# Altium schematic sheet rtc.SchDoc
size A4; Engineer: Amir Hossein Jobeiri; Organization: Simaran; SheetNumber: 15; SheetTotal: 24
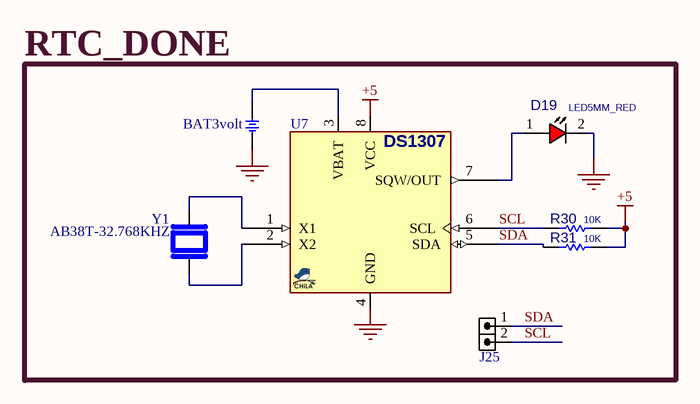
[diagram p0: rtc.SchDoc]

## Parts
BT1  BAT3volt  [BTH2032]
D19  LED5MM_RED  [LED5MM_RED]
J25  HDRM2  [HDR_M_1X2]  (value not drawn)
R30  10K  [R025W_AX04]
R31  10K  [R025W_AX04]
U7  DS1307  [DIP_8]  (value not drawn)
Y1  AB38T-32.768KHZ  [XTAL_AB38T-32.768KHZ]

## Blocks framed on the sheet
RTC_DONE: BT1 D19 J25 R30 R31 U7 Y1

## Nets
+5: R30.1 R31.1 U7.8(VCC)
GND: BT1.2 D19.2(CATHODE) U7.4(GND)
SCL: J25.2 R30.2 U7.6(SCL)
SDA: J25.1 R31.2 U7.5(SDA)
NetBT1_1: BT1.1 U7.3(VBAT)
NetD19_1: D19.1(ANODE) U7.7(SQW/OUT)
NetU7_1: U7.1(X1) Y1.2
NetU7_2: U7.2(X2) Y1.1

## Library data of the parts
BT1 = BATH_CR2032: BATTERY HOLDER, CR2032; MANF_P#: -; .: http://www.chila.ir; VALUE: BAT3volt
D19 = LED_THD_5MM_RED: LED, THD, 5MM, RED; DESC: DESCRIPTION; MANF_P#: MANF_PART#; PARAM2: 2.2V; MANF: MANF; ASSEMBLY: ASSEMBLY; PRICE: PRICE; VALUE: LED5MM_RED
J25 = HDR_M_1X2: CONN, HEADER, Male, pitch: 2.54mm, 2POS; VALUE: HDRM2
R30 R31 = RES_THD: RESISTOR, THD; MANF_P#: RK73H1ETTP4701F; MANF: KOA SPEER; PARAM: 0.063W; DESC: DESCRIPTION; DIST#: MOUSER; PARAM2: 1%; ASSEMBLY: ASSEMBLY; PRICE: 100= 0.5$; VALUE: 10K
U7 = DS1307_DIP8: Real-Time Clock, 64 X8, I2C, 56B, Batt; MANF: Maxim Integrated; MANF_P#: DS1307N+; PARAM2: 4.5~5.5V; PARAM: 64 X8, I2C, 56B, Batt, -40~85oC; VALUE: DS1307; PRICE: 3.7$
Y1 = AB38T-32.768KHZ: MP: AB38T-32.768KHZ; Price: None; Package: None; Availability: Unavailable; Value: *